# Altium project Robotic-Insect-Controller-Keypad-V1.PrjPcb
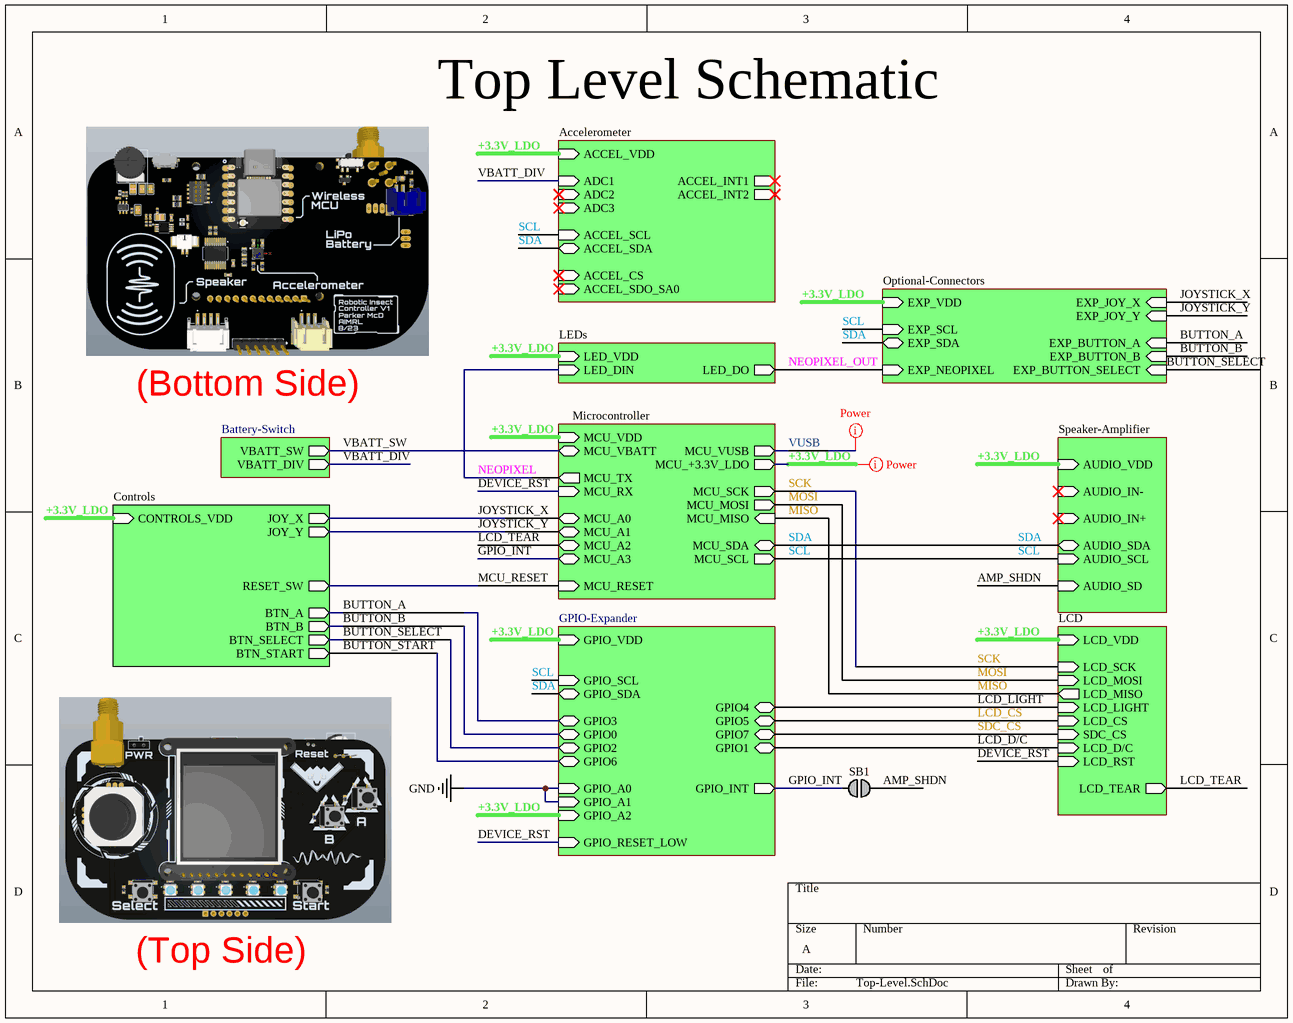
[diagram p0: Top-Level.SchDoc]
10 sheets, 73 parts. Net scope: hierarchical (ports join the sheet entries above them; power ports are global).
Board file: Robotic-Insect-Control-Keypad-V1.PcbDoc
Sheets:
  Top-Level.SchDoc
    Accelerometer = Accelerometer.SchDoc
    LCD = LCD.SchDoc
    Controls = Controls.SchDoc
    LEDs = LEDs.SchDoc
    Microcontroller = Microcontroller.SchDoc
    GPIO-Expander = GPIO-Expander.SchDoc
    Battery-Switch = Battery-Switch.SchDoc
    Speaker-Amplifier = Speaker-Amplifier.SchDoc
    Optional-Connectors = Optional-Connectors.SchDoc

## Sheet Top-Level.SchDoc
size A; SheetNumber: 1; SheetTotal: 10

### Parts
SB1  SB-OPEN-NO-PASTE  [PCB-SOLDERJUMPER-NOPASTE]  (value not drawn)  (no BOM)

### Sub-sheets
Accelerometer = Accelerometer.SchDoc: ACCEL_SDA (bidir), ACCEL_SCL (in), ACCEL_INT1 (out), ACCEL_INT2 (out), ADC1 (in), ADC2 (in), ADC3 (in), ACCEL_VDD (in), ACCEL_SDO_SA0 (in), ACCEL_CS (in)
Battery-Switch = Battery-Switch.SchDoc: VBATT_DIV (out), VBATT_SW (out)
Controls = Controls.SchDoc: BTN_A (out), BTN_B (out), BTN_SELECT (out), BTN_START (out), JOY_X (out), JOY_Y (out), CONTROLS_VDD (in), RESET_SW (out)
GPIO-Expander = GPIO-Expander.SchDoc: GPIO_SCL (in), GPIO_SDA (bidir), GPIO_RESET_LOW (in), GPIO_INT (out), GPIO_A0 (in), GPIO_A1 (in), GPIO_A2 (in), GPIO_VDD (in), GPIO0 (bidir), GPIO1 (bidir), GPIO2 (bidir), GPIO3 (bidir), GPIO4 (bidir), GPIO5 (bidir), GPIO6 (bidir), GPIO7 (bidir)
LCD = LCD.SchDoc: LCD_MOSI (in), LCD_MISO (out), LCD_SCK (in), LCD_CS (in), LCD_RST (in), LCD_D/C (in), SDC_CS (in), LCD_LIGHT (in), LCD_TEAR (out), LCD_VDD (in)
LEDs = LEDs.SchDoc: LED_DIN (in), LED_DO (out), LED_VDD (in)
Microcontroller = Microcontroller.SchDoc: MCU_RX (in), MCU_TX (out), MCU_SCL (out), MCU_SDA (bidir), MCU_MOSI (out), MCU_MISO (in), MCU_SCK (out), MCU_VUSB (out), MCU_A0 (bidir), MCU_A1 (bidir), MCU_A2 (bidir), MCU_A3 (bidir), MCU_RESET (in), MCU_+3.3V_LDO (out), MCU_VBATT (bidir), MCU_VDD (in)
Optional-Connectors = Optional-Connectors.SchDoc: EXP_SDA (bidir), EXP_SCL (in), EXP_VDD (in), EXP_NEOPIXEL (in), EXP_JOY_X (in), EXP_JOY_Y (in), EXP_BUTTON_A (in), EXP_BUTTON_B (in), EXP_BUTTON_SELECT (in)
Speaker-Amplifier = Speaker-Amplifier.SchDoc: AUDIO_SCL (in), AUDIO_SDA (bidir), AUDIO_VDD (in), AUDIO_SD (in), AUDIO_IN- (in), AUDIO_IN+ (in)

### Nets
GND: sheet GPIO-Expander/GPIO_A0, sheet GPIO-Expander/GPIO_A1
+3.3V_LDO: sheet Accelerometer/ACCEL_VDD, sheet LCD/LCD_VDD, sheet Controls/CONTROLS_VDD, sheet LEDs/LED_VDD, sheet Microcontroller/MCU_+3.3V_LDO, sheet Microcontroller/MCU_VDD, sheet GPIO-Expander/GPIO_A2, sheet GPIO-Expander/GPIO_VDD, sheet Speaker-Amplifier/AUDIO_VDD, sheet Optional-Connectors/EXP_VDD
AMP_SHDN: SB1.1 ; sheet Speaker-Amplifier/AUDIO_SD  [project net ~{SD}]
BUTTON_A: sheet Controls/BTN_A, sheet GPIO-Expander/GPIO3, sheet Optional-Connectors/EXP_BUTTON_A
BUTTON_B: sheet Controls/BTN_B, sheet GPIO-Expander/GPIO0, sheet Optional-Connectors/EXP_BUTTON_B
BUTTON_SELECT: sheet Controls/BTN_SELECT, sheet GPIO-Expander/GPIO2, sheet Optional-Connectors/EXP_BUTTON_SELECT
BUTTON_START: sheet Controls/BTN_START, sheet GPIO-Expander/GPIO6
DEVICE_RST: sheet LCD/LCD_RST, sheet Microcontroller/MCU_RX, sheet GPIO-Expander/GPIO_RESET_LOW
GPIO_INT: SB1.2 ; sheet Microcontroller/MCU_A3, sheet GPIO-Expander/GPIO_INT
JOYSTICK_X: sheet Controls/JOY_X, sheet Microcontroller/MCU_A0, sheet Optional-Connectors/EXP_JOY_X  [project net JOY_X]
JOYSTICK_Y: sheet Controls/JOY_Y, sheet Microcontroller/MCU_A1, sheet Optional-Connectors/EXP_JOY_Y  [project net JOY_Y]
LCD_CS: sheet LCD/LCD_CS, sheet GPIO-Expander/GPIO5
LCD_D/C: sheet LCD/LCD_D/C, sheet GPIO-Expander/GPIO1
LCD_LIGHT: sheet LCD/LCD_LIGHT, sheet GPIO-Expander/GPIO4
LCD_TEAR: sheet LCD/LCD_TEAR, sheet Microcontroller/MCU_A2
MCU_RESET: sheet Controls/RESET_SW, sheet Microcontroller/MCU_RESET
MISO: sheet LCD/LCD_MISO, sheet Microcontroller/MCU_MISO
MOSI: sheet LCD/LCD_MOSI, sheet Microcontroller/MCU_MOSI
NEOPIXEL: sheet LEDs/LED_DIN, sheet Microcontroller/MCU_TX  [project net MCU_TX]
NEOPIXEL_OUT: sheet LEDs/LED_DO, sheet Optional-Connectors/EXP_NEOPIXEL
SCK: sheet LCD/LCD_SCK, sheet Microcontroller/MCU_SCK
SCL: sheet Accelerometer/ACCEL_SCL, sheet Microcontroller/MCU_SCL, sheet GPIO-Expander/GPIO_SCL, sheet Speaker-Amplifier/AUDIO_SCL, sheet Optional-Connectors/EXP_SCL
SDA: sheet Accelerometer/ACCEL_SDA, sheet Microcontroller/MCU_SDA, sheet GPIO-Expander/GPIO_SDA, sheet Speaker-Amplifier/AUDIO_SDA, sheet Optional-Connectors/EXP_SDA
SDC_CS: sheet LCD/SDC_CS, sheet GPIO-Expander/GPIO7
VBATT_DIV: sheet Accelerometer/ADC1, sheet Battery-Switch/VBATT_DIV
VBATT_SW: sheet Microcontroller/MCU_VBATT, sheet Battery-Switch/VBATT_SW

### Layout directives
net class Power: +3.3V_LDO, VUSB

### Notes on the sheet
- Top Level Schematic
- (Bottom Side)
- (Top Side)

### Library data of the parts
SB1 = CMP-090-000003-4: Solder bridge, normally open, no solder paste.

## Sheet Accelerometer.SchDoc
size A; SheetNumber: 3; SheetTotal: 6
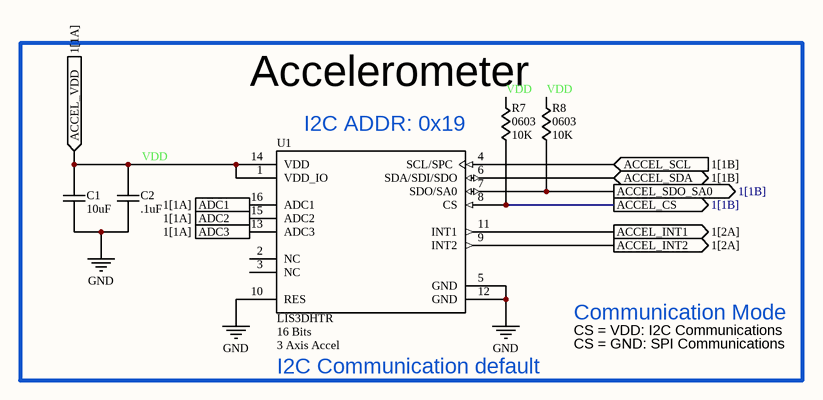
[diagram p1: Accelerometer.SchDoc]

### Parts
C1  value 10uF  [PCB-CAP-SMD-0603]  (hidden comment: CAP-SMD-0603)
C2  value .1uF  [PCB-CAP-SMD-0603]  (hidden comment: CAP-SMD-0603)
R7  value 10K  Footprint: 0603  [PCB-RES-SMD-0603]  (hidden comment: RES-SMD-0603)
R8  value 10K  Footprint: 0603  [PCB-RES-SMD-0603]  (hidden comment: RES-SMD-0603)
U1  Resolution: 16 Bits  Part Number: LIS3DHTR  Sensor Type: 3 Axis Accel  [PCB-LGA16_3X3MM]  (hidden comment: SEN-ACCEL-16BIT-LIS3DHTR)

### Ports
ACCEL_CS (out, see 1[1B]), ACCEL_INT1 (out, see 1[2A]), ACCEL_INT2 (out, see 1[2A]), ACCEL_SCL (in, see 1[1B]), ACCEL_SDA (bidir, see 1[1B]), ACCEL_SDO_SA0 (out, see 1[1B]), ACCEL_VDD (in, see 1[1A]), ADC1 (in, see 1[1A]), ADC2 (in, see 1[1A]), ADC3 (in, see 1[1A])

### Nets
GND: C1.2 C2.2 U1.5(GND) U1.10(RES) U1.12(GND)
SCL: U1.4(SCL/SPC) ; port ACCEL_SCL
SDA: U1.6(SDA/SDI/SDO) ; port ACCEL_SDA
VBATT_DIV: U1.16(ADC1) ; port ADC1
VDD: C1.1 C2.1 R7.2 R8.2 U1.1(VDD_IO) U1.14(VDD) ; port ACCEL_VDD  [project net +3.3V_LDO]
NetR7_1: R7.1 U1.8(CS) ; port ACCEL_CS
NetR8_1: R8.1 U1.7(SDO/SA0) ; port ACCEL_SDO_SA0
NetU1_9: U1.9(INT2) ; port ACCEL_INT2
NetU1_11: U1.11(INT1) ; port ACCEL_INT1
NetU1_13: U1.13(ADC3) ; port ADC3
NetU1_15: U1.15(ADC2) ; port ADC2

Not connected (* = marked no-connect by the designer): U1 2(NC) 3(NC)

### Notes on the sheet
- (near R7) Accelerometer
- (near U1) I2C ADDR: 0x19
- I2C Communication default
- Communication Mode
- CS = VDD: I2C Communications
- CS = GND: SPI Communications

### Library data of the parts
C1 C2 = CMP-00006-5: Generic (no part number) 0603 surface mount capacitor
R7 R8 = CMP-00002-4: Generic (no part number) 0603 surface mount resistor
U1 = CMP-062-000000-3: LIS3DHTR 3-Axis Accelerometer with I2C/SPI Interface    VDD: 1.71-3.6V  VDDIO: 1.71-VDD+0.1V  Scale: +/-2g, 4g, 8g, 16g with 16--bit data output  Temp:: -40Â°C - 85Â°C       Mouser: 511-LIS3DHTR Digikey: 497-10613-1-ND; Operating Supply Voltage: 2.5V; Axis: X, Y, Z; Operating Supply Current: 11uA; Interface: I2C,SPI; Max Supply Voltage (DC): 3.6V; Output Type: Digital; Bandwidth: 5kHz; Min Supply Voltage (DC): 1.71V; Max Operating Temperature: 85°C; Pins: 16; Height: 1mm; Depth: 3mm; Length: 3mm; Radiation Hardening: No; Lead Free: Lead Free; Min Operating Temperature: -40°C; RoHS Compliant: Yes; Packaging: Tape and Reel; Package Quantity: 4000; Series: -; Width: 3mm; Max Supply Voltage: 3.6V; Reach SVHC Compliant: No; Case/Package: LGA; Min Supply Voltage: 1.71V

## Sheet LCD.SchDoc
size A; SheetNumber: 4; SheetTotal: 6
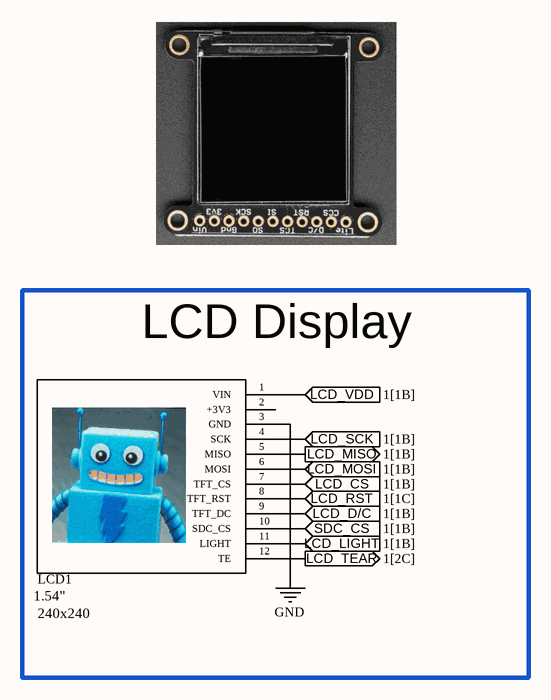
[diagram p2: LCD.SchDoc]

### Parts
LCD1  128x160: 240x240  1.8"TFT: 1.54"  [PCB-PCB-1.7X1.6-INCHES-DISP-LCD_QT154H2201]  (hidden comment: DISP-1.54-INCH-240x240-COLOR-LCD_QT154H2201)

### Blocks framed on the sheet
LCD Display: LCD1

### Ports
LCD_CS (in, see 1[1B]), LCD_D/C (in, see 1[1B]), LCD_LIGHT (in, see 1[1B]), LCD_MISO (out, see 1[1B]), LCD_MOSI (in, see 1[1B]), LCD_RST (in, see 1[1C]), LCD_SCK (in, see 1[1B]), LCD_TEAR (out, see 1[2C]), LCD_VDD (in, see 1[1B]), SDC_CS (in, see 1[1B])

### Nets
GND: LCD1.3(GND)
+3.3V_LDO: LCD1.1(VIN) ; port LCD_VDD
DEVICE_RST: LCD1.8(TFT_RST) ; port LCD_RST
LCD_CS: LCD1.7(TFT_CS) ; port LCD_CS
LCD_D/C: LCD1.9(TFT_DC) ; port LCD_D/C
LCD_LIGHT: LCD1.11(LIGHT) ; port LCD_LIGHT
LCD_TEAR: LCD1.12(TE) ; port LCD_TEAR
MISO: LCD1.5(MISO) ; port LCD_MISO
MOSI: LCD1.6(MOSI) ; port LCD_MOSI
SCK: LCD1.4(SCK) ; port LCD_SCK
SDC_CS: LCD1.10(SDC_CS) ; port SDC_CS

Not connected (* = marked no-connect by the designer): LCD1 2(+3V3)

### Library data of the parts
LCD1 = CMP-00049-4: Adafruit 1.54" 240x240 Wide Angle TFT LCD Display with MicroSD - ST7789 with EYESPI Connector; Part Number: 618

## Sheet Controls.SchDoc
size A; SheetNumber: 2; SheetTotal: 9
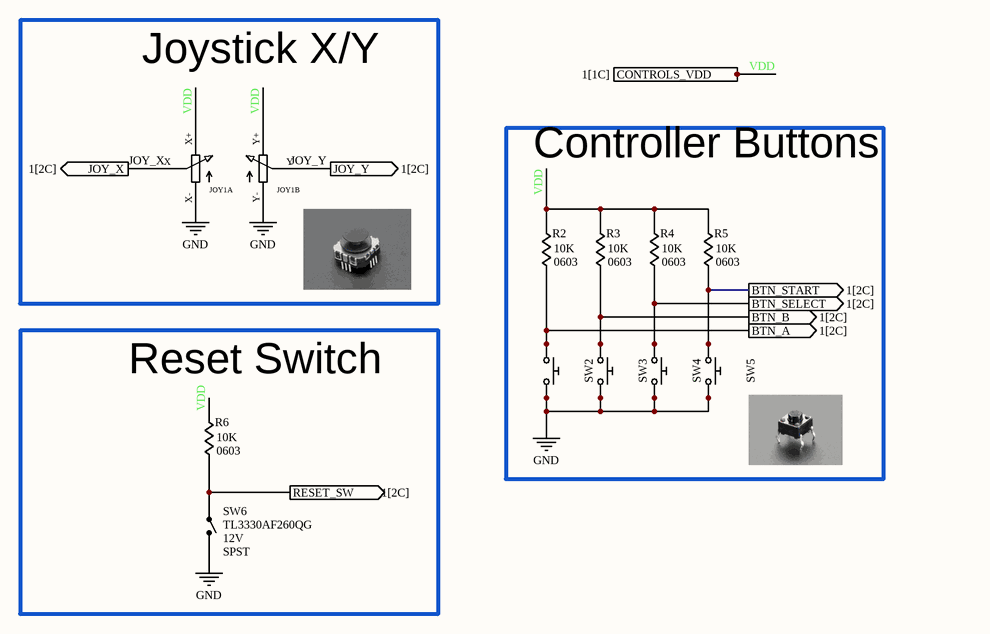
[diagram p3: Controls.SchDoc]

### Parts
JOY1  CTRL-JOYSTICK_ANALOG_XY  [PCB-JOYSTICK-ANALOG_MINITHM]  (value not drawn)  (parts A,B of 2)
R2  value 10K  Footprint: 0603  [PCB-RES-SMD-0603]  (hidden comment: RES-SMD-0603)
R3  value 10K  Footprint: 0603  [PCB-RES-SMD-0603]  (hidden comment: RES-SMD-0603)
R4  value 10K  Footprint: 0603  [PCB-RES-SMD-0603]  (hidden comment: RES-SMD-0603)
R5  value 10K  Footprint: 0603  [PCB-RES-SMD-0603]  (hidden comment: RES-SMD-0603)
R6  value 10K  Footprint: 0603  [PCB-RES-SMD-0603]  (hidden comment: RES-SMD-0603)
SW2  SWITCH-SMD-SMT-6MM  [PCB-SMD-SWITCH-6MM]  (value not drawn)
SW3  SWITCH-SMD-SMT-6MM  [PCB-SMD-SWITCH-6MM]  (value not drawn)
SW4  SWITCH-SMD-SMT-6MM  [PCB-SMD-SWITCH-6MM]  (value not drawn)
SW5  SWITCH-SMD-SMT-6MM  [PCB-SMD-SWITCH-6MM]  (value not drawn)
SW6  Voltage Rating (DC): 12V  Throw Configuration: SPST  Part Number: TL3330AF260QG  [PCB-SPST-TACTILE-RA]  (hidden comment: SWITCH-SPST-TACT-RA)

### Blocks framed on the sheet
Joystick X/Y: JOY1
Controller Buttons: R2-R5 SW2-SW5
Reset Switch: R6 SW6

### Ports
BTN_A (out, see 1[2C]), BTN_B (out, see 1[2C]), BTN_SELECT (out, see 1[2C]), BTN_START (out, see 1[2C]), CONTROLS_VDD (in, see 1[1C]), JOY_X (out, see 1[2C]), JOY_Y (out, see 1[2C]), RESET_SW (out, see 1[2C])

### Nets
GND: JOY1.X-(A) JOY1.Y-(A) SW2.B(S) SW2.B'(S1) SW3.B(S) SW3.B'(S1) SW4.B(S) SW4.B'(S1) SW5.B(S) SW5.B'(S1) SW6.2(S)
BUTTON_A: R2.1 SW2.A(P) SW2.A'(P1) ; port BTN_A
BUTTON_B: R3.1 SW3.A(P) SW3.A'(P1) ; port BTN_B
BUTTON_SELECT: R4.1 SW4.A(P) SW4.A'(P1) ; port BTN_SELECT
BUTTON_START: R5.1 SW5.A(P) SW5.A'(P1) ; port BTN_START
JOY_X: JOY1.X(S) ; port JOY_X
JOY_Y: JOY1.Y(S) ; port JOY_Y
MCU_RESET: R6.1 SW6.1(P) ; port RESET_SW
VDD: JOY1.X+(E) JOY1.Y+(E) R2.2 R3.2 R4.2 R5.2 R6.2 ; port CONTROLS_VDD  [project net +3.3V_LDO]
NetSW6_MT1: SW6.MT1(MT) SW6.MT2(MT)

### Library data of the parts
JOY1 = CMP-069-000000-7: 2-Axis analog joystick
R2-R6 = CMP-00002-4: as R7 on sheet Accelerometer
SW2-SW5 = CMP-067-000001-3: 6mm diameter tactile switch.; SymbolName_1: BUTTON_4PIN; GateName_1: G$1; DeviceSetName: SWITCH_TACT_SMT; DeviceName: _6MM8MMCAP; LibraryName: Adafruit PyGamer; Design Item ID: SWITCH_TACT_SMT_6MM8MMCAP; Source: Adafruit PyGamer.SCHLIB; Pin Count: 4; Component Type: Standard
SW6 = CMP-067-000003-2: Switch Tactile N.O. SPST Rectangular Button Gull Wing 0.05A 12VDC 2.55N SMD; Actuator Material: Nylon,Polyamide; Mechanical Life: 30000Cycles; Switch Travel: 0.25mm; Actuator Length: 1mm; Contact Resistance: 100mR; Operating Force: 260gf; Current Rating: 50mA; Switch Function: Off-Mom; Illumination Type: Non-Illuminated; Contact Material: Silver; Termination: Gull Wing; RoHS Compliant: Yes; Max Voltage Rating (DC): 12V; Mounting Technology: Surface Mount; Contact Plating: Silver; Series: TL3330; Electrical Life: 30000Cycles; Orientation: Right Angle; Min Operating Temperature: -20°C; Lead Free: Lead Free; Size: 3.4mm; Color: Black; Packaging: Tape and Reel; Case/Package: SMD/SMT; Package Quantity: 2300; Max Operating Temperature: 70°C

## Sheet LEDs.SchDoc
size A; SheetNumber: 5; SheetTotal: 9
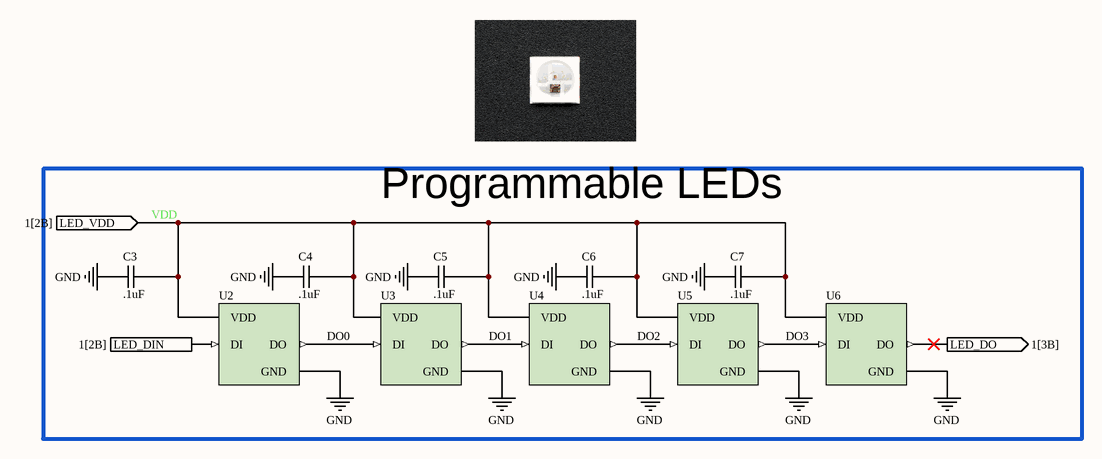
[diagram p4: LEDs.SchDoc]

### Parts
C3  value .1uF  [PCB-CAP-SMD-0603]  (hidden comment: CAP-SMD-0603)
C4  value .1uF  [PCB-CAP-SMD-0603]  (hidden comment: CAP-SMD-0603)
C5  value .1uF  [PCB-CAP-SMD-0603]  (hidden comment: CAP-SMD-0603)
C6  value .1uF  [PCB-CAP-SMD-0603]  (hidden comment: CAP-SMD-0603)
C7  value .1uF  [PCB-CAP-SMD-0603]  (hidden comment: CAP-SMD-0603)
U2  LED-RGB-SK6812B-3535  [PCB-SK6812B-3535-SMD-3.5X3.7MM]  (value not drawn)
U3  LED-RGB-SK6812B-3535  [PCB-SK6812B-3535-SMD-3.5X3.7MM]  (value not drawn)
U4  LED-RGB-SK6812B-3535  [PCB-SK6812B-3535-SMD-3.5X3.7MM]  (value not drawn)
U5  LED-RGB-SK6812B-3535  [PCB-SK6812B-3535-SMD-3.5X3.7MM]  (value not drawn)
U6  LED-RGB-SK6812B-3535  [PCB-SK6812B-3535-SMD-3.5X3.7MM]  (value not drawn)

### Blocks framed on the sheet
Programmable LEDs: C3-C7 U2-U6

### Ports
LED_DIN (in, see 1[2B]), LED_DO (out, see 1[3B]), LED_VDD (in, see 1[2B])

### Nets
GND: C3.1 C4.1 C5.1 C6.1 C7.1 U2.4(GND) U3.4(GND) U4.4(GND) U5.4(GND) U6.4(GND)
DO0: U2.3(DO) U3.1(DI)  [project net DO0_5]
DO1: U3.3(DO) U4.1(DI)  [project net DO1_5]
DO2: U4.3(DO) U5.1(DI)  [project net DO2_5]
DO3: U5.3(DO) U6.1(DI)  [project net DO3_5]
MCU_TX: U2.1(DI) ; port LED_DIN
NEOPIXEL_OUT: U6.3(DO) ; port LED_DO
VDD: C3.2 C4.2 C5.2 C6.2 C7.2 U2.2(VDD) U3.2(VDD) U4.2(VDD) U5.2(VDD) U6.2(VDD) ; port LED_VDD  [project net +3.3V_LDO]

### Library data of the parts
C3-C7 = CMP-00006-5: as C1 on sheet Accelerometer
U2-U6 = CMP-018-000000-9: 3.5x3.7x1.1 mm 0.2W Intelligent external control surface; SymbolName_1: WS2812BLED; DeviceSetName: WS2812B; DeviceName: 3535; GateName_1: G$1; LibraryName: adafruit; Package: LED3535; Source: adafruit.SCHLIB; Pin Count: 4; Design Item ID: WS2812B3535; Component Type: Standard

## Sheet Microcontroller.SchDoc
size A; SheetNumber: 6; SheetTotal: 9
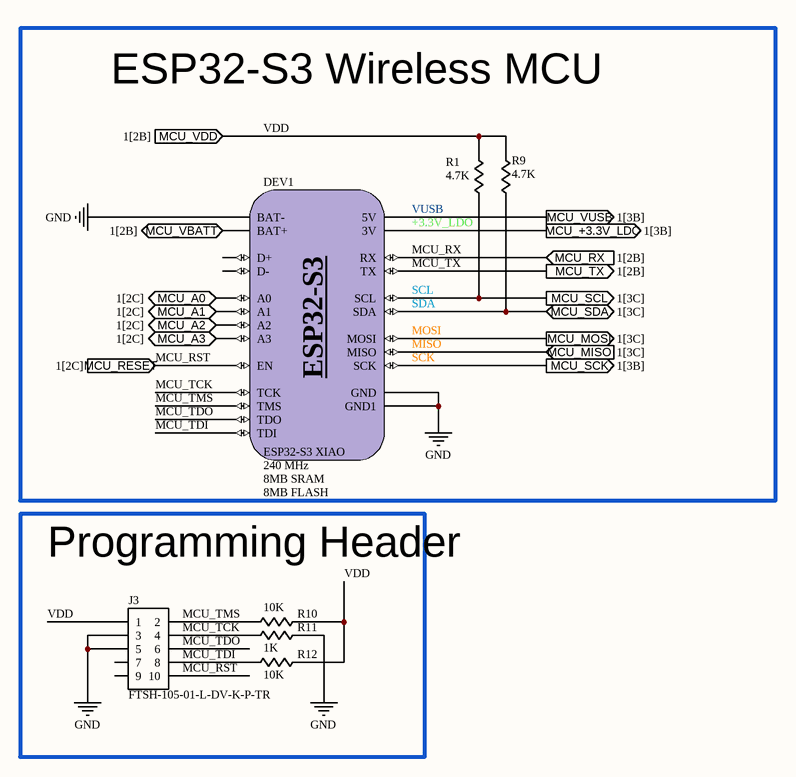
[diagram p5: Microcontroller.SchDoc]

### Parts
DEV1  RAM: 8MB SRAM  Flash: 8MB FLASH  Speed: 240 MHz  Part Number: ESP32-S3 XIAO  [PCB-ESP32-S3-XIAO-SMD]  (hidden comment: MCU-DEV-ESP32-S3-XIAO)
J3  Part Number: FTSH-105-01-L-DV-K-P-TR  [PCB-BOX-HEADER-10PIN-FP-FTSH-105-01-L-DV-K-P-T-MFG]  (hidden comment: CONN-BOX-HDR-10PIN-FTSH-105-01-L-DV-K-P-TR)
R1  value 4.7K  [PCB-RES-SMD-0805]  (hidden comment: RES-SMD-0805)
R9  value 4.7K  [PCB-RES-SMD-0805]  (hidden comment: RES-SMD-0805)
R10  value 10K  [PCB-RES-SMD-0805]  (hidden comment: RES-SMD-0805)
R11  value 1K  [PCB-RES-SMD-0805]  (hidden comment: RES-SMD-0805)
R12  value 10K  [PCB-RES-SMD-0805]  (hidden comment: RES-SMD-0805)

### Blocks framed on the sheet
ESP32-S3 Wireless MCU: DEV1 R1 R9
Programming Header: J3 R10-R12

### Ports
MCU_+3.3V_LDO (out, see 1[3B]), MCU_A0 (bidir, see 1[2C]), MCU_A1 (bidir, see 1[2C]), MCU_A2 (bidir, see 1[2C]), MCU_A3 (bidir, see 1[2C]), MCU_MISO (in, see 1[3C]), MCU_MOSI (out, see 1[3C]), MCU_RESET (in, see 1[2C]), MCU_RX (in, see 1[2B]), MCU_SCK (out, see 1[3B]), MCU_SCL (out, see 1[3C]), MCU_SDA (bidir, see 1[3C]), MCU_TX (out, see 1[2B]), MCU_VBATT (bidir, see 1[2B]), MCU_VDD (in, see 1[2B]), MCU_VUSB (out, see 1[3B])

### Nets
GND: DEV1.BAT- DEV1.GND DEV1.GND1 J3.3 J3.5 R11.2
+3.3V_LDO: DEV1.3V J3.1 R1.2 R9.2 R10.2 R12.2 ; port MCU_+3.3V_LDO, port MCU_VDD  [also labelled VDD]
GPIO_INT: DEV1.A3 ; port MCU_A3
JOY_X: DEV1.A0 ; port MCU_A0
JOY_Y: DEV1.A1 ; port MCU_A1
LCD_TEAR: DEV1.A2 ; port MCU_A2
MCU_RST: DEV1.EN J3.10 ; port MCU_RESET  [project net MCU_RESET]
MCU_RX: DEV1.RX ; port MCU_RX  [project net DEVICE_RST]
MCU_TCK: DEV1.TCK J3.4 R11.1  [project net MCU_TCK_6]
MCU_TDI: DEV1.TDI J3.8 R12.1  [project net MCU_TDI_6]
MCU_TDO: DEV1.TDO J3.6  [project net MCU_TDO_6]
MCU_TMS: DEV1.TMS J3.2 R10.1  [project net MCU_TMS_6]
MCU_TX: DEV1.TX ; port MCU_TX
MISO: DEV1.MISO ; port MCU_MISO
MOSI: DEV1.MOSI ; port MCU_MOSI
SCK: DEV1.SCK ; port MCU_SCK
SCL: DEV1.SCL R1.1 ; port MCU_SCL
SDA: DEV1.SDA R9.1 ; port MCU_SDA
VBATT_SW: DEV1.BAT+ ; port MCU_VBATT
VUSB: DEV1.5V ; port MCU_VUSB

Not connected (* = marked no-connect by the designer): DEV1 D+ D-; J3 7 9

### Notes on the sheet
- (in symbol CMP-00021-5) ESP32-S3

### Library data of the parts
DEV1 = CMP-00021-5: SMD IC ESP32-S3, Dual-core MCU with WiFi and BLE support.
J3 = CMP-00034-4: Conn Unshrouded Header HDR 10 POS 1.27mm Solder ST Top Entry SMD T/R; Max Current Rating: 1.75A; Number of Positions: 10; Gender: Male; Contact Shape: Square; Flammability Rating: UL94 V-0; Fastening Type: Pull; Length: 6.35mm; RoHS Compliant: Yes; Housing Color: Black; Contact Material: Bronze; Packaging: Tape and Reel; Contact Type: Male Pin; Number of Rows: 2; Contact Plating: Gold; Orientation: Straight; Series: FTSH; Lead Free: Lead Free; Termination: Solder; Number of Contacts: 10; Insulation Color: Black; Pitch: 1.27mm; Housing Material: Polymer; Insulation Material: Polymer; Min Operating Temperature: -55°C; Radiation Hardening: No; Depth: 5.84mm; Max Operating Temperature: 125°C
R1 R9-R12 = CMP-00003-4: Generic (no part number) 0805 surface mount resistor

## Sheet GPIO-Expander.SchDoc
size A; SheetNumber: 8; SheetTotal: 9
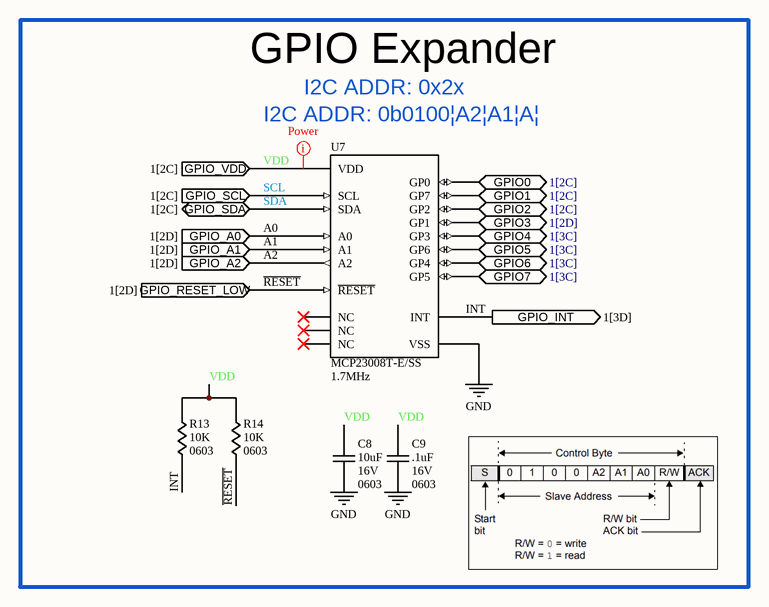
[diagram p6: GPIO-Expander.SchDoc]

### Parts
C8  value 10uF  Voltage: 16V  Footprint: 0603  [PCB-CAP-SMD-0603]  (hidden comment: CAP-SMD-0603)
C9  value .1uF  Voltage: 16V  Footprint: 0603  [PCB-CAP-SMD-0603]  (hidden comment: CAP-SMD-0603)
R13  value 10K  Footprint: 0603  [PCB-RES-SMD-0603]  (hidden comment: RES-SMD-0603)
R14  value 10K  Footprint: 0603  [PCB-RES-SMD-0603]  (hidden comment: RES-SMD-0603)
U7  Frequency: 1.7MHz  Part Number: MCP23008T-E/SS  [PCB-TSSOP-20-.65MM-7.2x5.2MM]  (hidden comment: IC-GPIO-EXPANDER-I2C-8CH-MCP23008T-E/SS)

### Ports
GPIO0 (bidir, see 1[2C]), GPIO1 (bidir, see 1[2C]), GPIO2 (bidir, see 1[2C]), GPIO3 (bidir, see 1[2D]), GPIO4 (bidir, see 1[3C]), GPIO5 (bidir, see 1[3C]), GPIO6 (bidir, see 1[3C]), GPIO7 (bidir, see 1[3C]), GPIO_A0 (in, see 1[2D]), GPIO_A1 (in, see 1[2D]), GPIO_A2 (in, see 1[2D]), GPIO_INT (out, see 1[3D]), GPIO_RESET_LOW (in, see 1[2D]), GPIO_SCL (in, see 1[2C]), GPIO_SDA (bidir, see 1[2C]), GPIO_VDD (in, see 1[2C])

### Nets
GND: C8.1 C9.1 U7.4(A1) U7.5(A0) U7.9(VSS) ; port GPIO_A0, port GPIO_A1  [also labelled A0, A1]
A2: C8.2 C9.2 R13.2 R14.2 U7.3(A2) U7.20(VDD) ; port GPIO_A2, port GPIO_VDD  [also labelled VDD]  [project net +3.3V_LDO]
BUTTON_A: U7.13(GP1) ; port GPIO3
BUTTON_B: U7.12(GP0) ; port GPIO0
BUTTON_SELECT: U7.14(GP2) ; port GPIO2
BUTTON_START: U7.16(GP4) ; port GPIO6
INT: R13.1 U7.8(INT) ; port GPIO_INT  [project net GPIO_INT]
LCD_CS: U7.18(GP6) ; port GPIO5
LCD_D/C: U7.19(GP7) ; port GPIO1
LCD_LIGHT: U7.15(GP3) ; port GPIO4
~{RESET}: R14.1 U7.6(~{RESET}) ; port GPIO_RESET_LOW  [project net DEVICE_RST]
SCL: U7.1(SCL) ; port GPIO_SCL
SDA: U7.2(SDA) ; port GPIO_SDA
SDC_CS: U7.17(GP5) ; port GPIO7

Not connected (* = marked no-connect by the designer): U7 7(NC)* 10(NC)* 11(NC)*

### Layout directives
net class Power: +3.3V_LDO

### Notes on the sheet
- GPIO Expander
- I2C ADDR: 0x2x
- (near U7) I2C ADDR: 0b0100|A2|A1|A|

### Library data of the parts
C8 C9 = CMP-00006-5: as C1 on sheet Accelerometer
R13 R14 = CMP-00002-4: as R7 on sheet Accelerometer
U7 = CMP-00069-3: MCP23008 Series 5.5 V 1.7 MHz 8-Bit I/O Expander with Serial Interface - SSOP-20; Interface: I2C,Serial; Operating Supply Voltage: 5.5V; Power Dissipation: 700mW; Supply Current: 1mA; Output Type: PUSH-PULL; Number of I/Os: 8; Number of Channels: 1; Lead Free: Lead Free; Package Quantity: 1600; Series: -; Case/Package: SSOP; Pins: 20; Min Operating Temperature: -40°C; RoHS Compliant: Yes; Nominal Supply Voltage: 5.5V; Packaging: Tape and Reel; Max Operating Temperature: 125°C; Clock Frequency: 1.7MHz

## Sheet Battery-Switch.SchDoc
size A; SheetNumber: 8; SheetTotal: 10
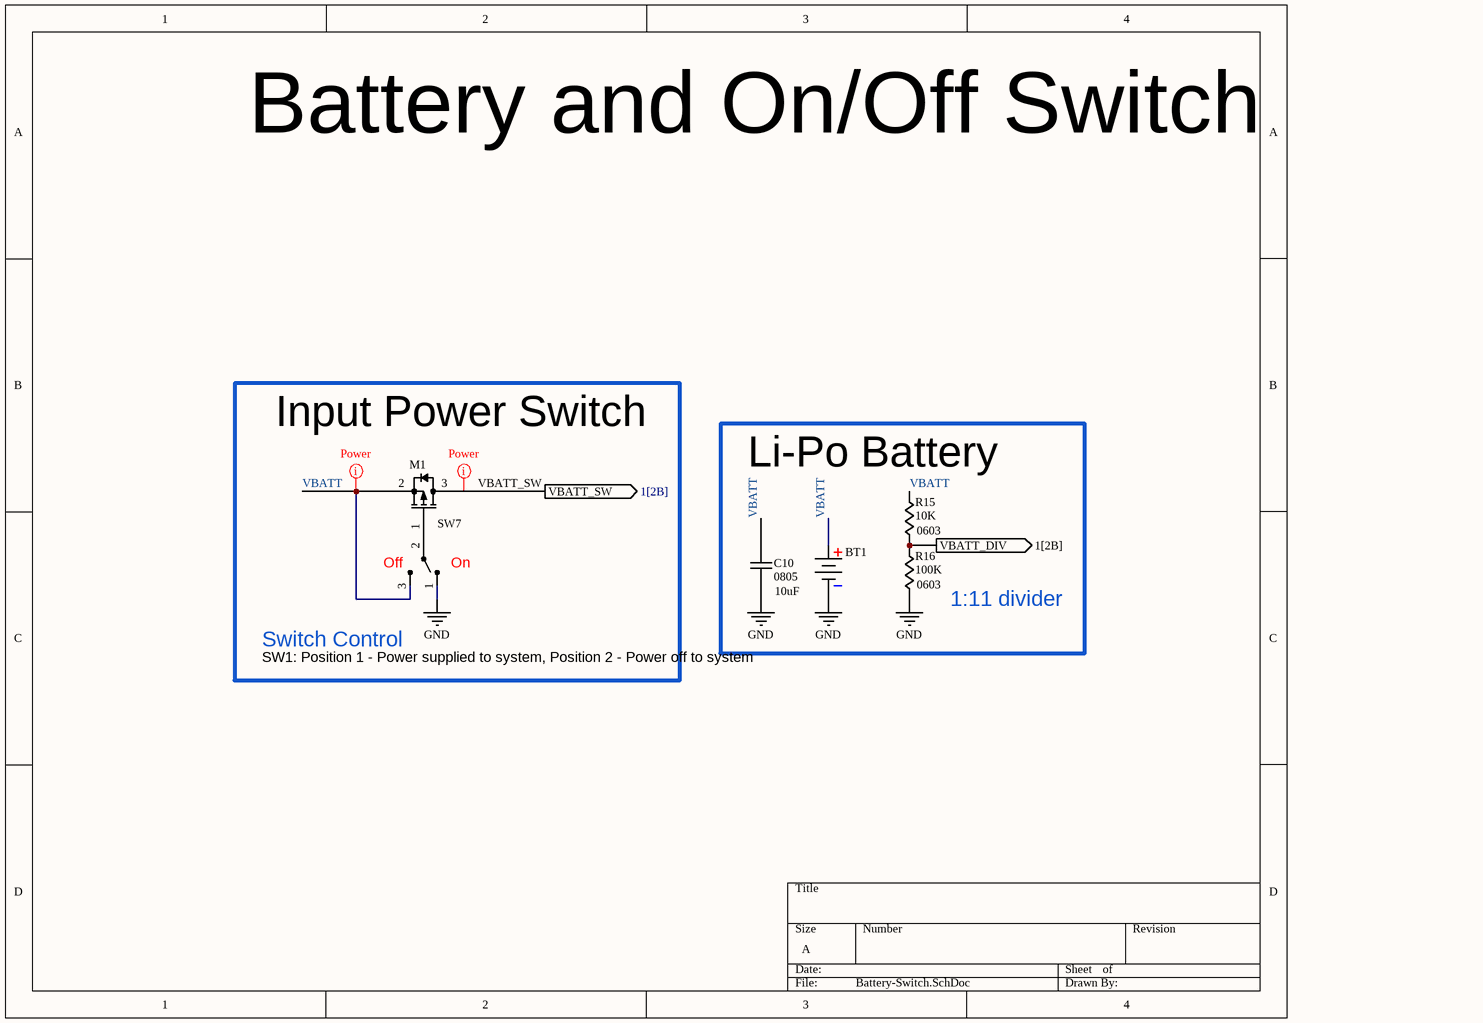
[diagram p7: Battery-Switch.SchDoc]

### Parts
BT1  BATT-JST-S2BPHSM4TBLFSN  [PCB-CONN-JST- S2B-PH-SM4-TB(LF)(SN)-2_V]  (value not drawn)
C10  value 10uF  Footprint: 0805  [PCB-CAP-SMA-0805]  (hidden comment: CAP-SMD-0805)
M1  TR-MOSFET-P-CH-SOT-23-GENERIC  [PCB-SOT-23]  (value not drawn)
R15  value 10K  Footprint: 0603  [PCB-RES-SMD-0603]  (hidden comment: RES-SMD-0603)
R16  value 100K  Footprint: 0603  [PCB-RES-SMD-0603]  (hidden comment: RES-SMD-0603)
SW7  SWITCH-SPDT-SMD-SSSS811101  [PCB-SPDT_SMT_SSSS811101]  (value not drawn)

### Blocks framed on the sheet
Input Power Switch: M1 SW7
Li-Po Battery: BT1 C10 R15 R16

### Ports
VBATT_DIV (out, see 1[2B]), VBATT_SW (out, see 1[2B])

### Nets
GND: BT1.2 C10.1 R16.2 SW7.1
VBATT: BT1.1 C10.2 M1.2(S) R15.1 SW7.3  [project net VBATT_8]
VBATT_DIV: R15.2 R16.1 ; port VBATT_DIV
VBATT_SW: M1.3(D) ; port VBATT_SW
NetM1_1: M1.1(G) SW7.2

Not connected (* = marked no-connect by the designer): BT1 MP1 MP2

### Layout directives
net class Power: VBATT_8, VBATT_SW

### Notes on the sheet
- Battery and On/Off Switch
- (near SW7) Off
- (near SW7) On
- 1:11 divider
- SW1: Position 1 - Power supplied to system, Position 2 - Power off to system
- Switch Control

### Library data of the parts
BT1 = CMP-002-00007-1: Connector Header, PH Series, 2 Position, Side Entry, 2.00mm, Solder, Surface Mount, Natural for connecting to a battery.; Insulation Resistance: 1GR; Contact Resistance: 20mR; Current Rating: 2A; Working Voltage: 100V; Gender: Male; Pitch: 2mm; Number of Contacts: 2; Depth: 8.6mm; Lead Free: Lead Free; Series: PH; Length: 7.9mm; Flammability Rating: UL94 V-0; Max Operating Temperature: 85°C; Contact Material: Tin,Copper Alloy,Bronze,Brass; Reach SVHC Compliant: No; Min Operating Temperature: -25°C; Width: 5mm; Packaging: Tape and Reel; Color: White; Voltage Rating (AC): 100V; Contact Plating: Tin,Copper; Housing Material: Polyamide; Number of Rows: 1; Max Voltage Rating (AC): 100V; Orientation: Right Angle; Voltage Rating: 100V; Max Current Rating: 2A; Housing Color: Beige; Termination: Solder; Height: 9.4mm
C10 = CMP-00007-4: Generic (no part number) 0805 surface mount resistor
M1 = CMP-00035-6: MOSFET P-CH 20V 1.3A SOT-23
R15 R16 = CMP-00002-4: as R7 on sheet Accelerometer
SW7 = CMP-067-000002-3: Toggle switch; GateName_1: G$1; DeviceSetName: SWITCH_SPDT; Component Type: Standard; SymbolName_1: SWITCH_SPDT; LibraryName: Adafruit PyGamer; Design Item ID: SWITCH_SPDT; Package: SPDT_SMT_SSSS811101; Pin Count: 3; Source: Adafruit PyGamer.SCHLIB

## Sheet Speaker-Amplifier.SchDoc
size A; SheetNumber: 9; SheetTotal: 9
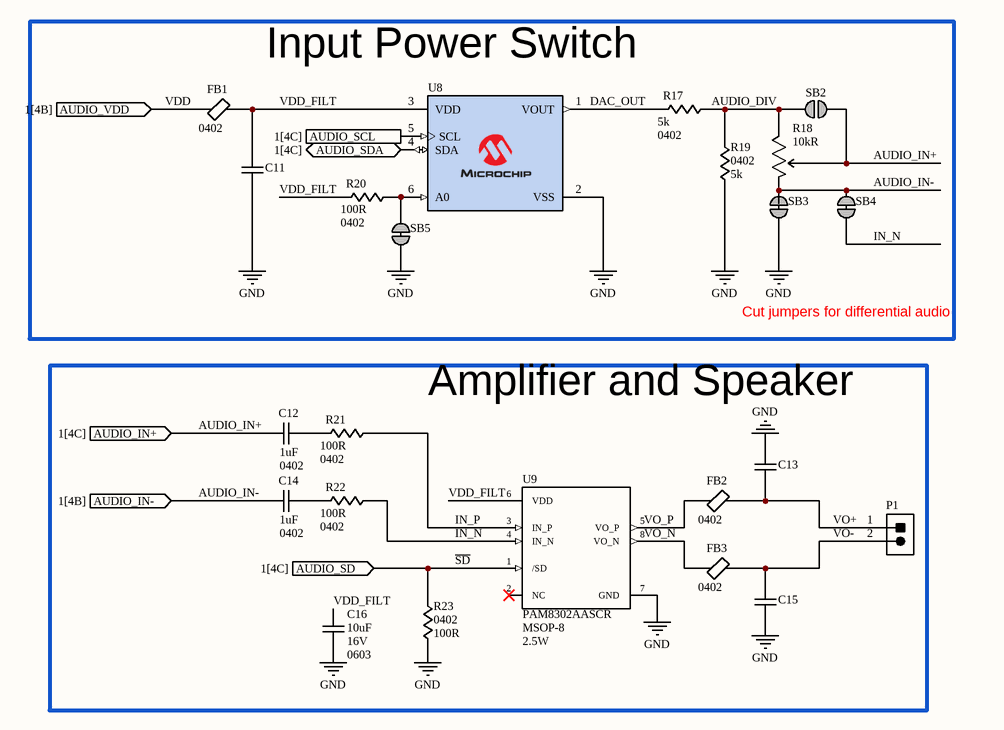
[diagram p8: Speaker-Amplifier.SchDoc]

### Parts
C11  CAP-SMD-0402  [PCB-CAP-SMD-0402]  (value not drawn)
C12  value 1uF  Voltage: 0402  [PCB-CAP-SMD-0402]  (hidden comment: CAP-SMD-0402)
C13  CAP-SMD-0402  [PCB-CAP-SMD-0402]  (value not drawn)
C14  value 1uF  Voltage: 0402  [PCB-CAP-SMD-0402]  (hidden comment: CAP-SMD-0402)
C15  CAP-SMD-0402  [PCB-CAP-SMD-0402]  (value not drawn)
C16  value 10uF  Voltage: 16V  Footprint: 0603  [PCB-CAP-SMD-0603]  (hidden comment: CAP-SMD-0603)
FB1  Footprint: 0402  [PCB-SMD-FERRITE-0402]  (hidden comment: FERRITE-SMD-GENERIC-0402)
FB2  Footprint: 0402  [PCB-SMD-FERRITE-0402]  (hidden comment: FERRITE-SMD-GENERIC-0402)
FB3  Footprint: 0402  [PCB-SMD-FERRITE-0402]  (hidden comment: FERRITE-SMD-GENERIC-0402)
P1  CONN-PICOBLADE-SMD-1.25MM-2PIN-53261-0271  [PCB-PICOBLADE-2PIN-1.25MM]  (value not drawn)
R17  value 5k  Footprint: 0402  [PCB-RES-SMA-0402]  (hidden comment: RES-SMD-0402)
R18  value 10kR  [PCB-FP-3352T-MFG]  (hidden comment: POT-THUMB-9MM-3352T-1-103LF)
R19  value 5k  Footprint: 0402  [PCB-RES-SMA-0402]  (hidden comment: RES-SMD-0402)
R20  value 100R  Footprint: 0402  [PCB-RES-SMA-0402]  (hidden comment: RES-SMD-0402)
R21  value 100R  Footprint: 0402  [PCB-RES-SMA-0402]  (hidden comment: RES-SMD-0402)
R22  value 100R  Footprint: 0402  [PCB-RES-SMA-0402]  (hidden comment: RES-SMD-0402)
R23  value 100R  Footprint: 0402  [PCB-RES-SMA-0402]  (hidden comment: RES-SMD-0402)
SB2  SB-OPEN-NO-PASTE  [PCB-SOLDERJUMPER-NOPASTE]  (value not drawn)  (no BOM)
SB3  SB-CLOSED-NO-PASTE  [-SOLDERJUMPER-CLOSEDWIRE]  (value not drawn)  (net tie, no BOM)
SB4  SB-CLOSED-NO-PASTE  [-SOLDERJUMPER-CLOSEDWIRE]  (value not drawn)  (net tie, no BOM)
SB5  SB-CLOSED-NO-PASTE  [-SOLDERJUMPER-CLOSEDWIRE]  (value not drawn)  (net tie, no BOM)
U8  IC-DAC-12BIT-1CH-I2C-MCP4725A0T-E/CH  [PCB-MCP4725-MSOP-10-3X3MM]  (value not drawn)
U9  Case/Package: MSOP-8  Output Power: 2.5W  Part Number: PAM8302AASCR  [PCB-MSOP-8-.65MM]  (hidden comment: IC-AUDIO-AMP-2.5W-PAM8302AASCR)

### Blocks framed on the sheet
Input Power Switch: C11 FB1 R17-R20 SB2-SB5 U8
Amplifier and Speaker: C12-C16 FB2 FB3 P1 R21-R23 U9

### Ports
AUDIO_IN+ (in, see 1[4C]), AUDIO_IN- (in, see 1[4B]), AUDIO_SCL (in, see 1[4C]), AUDIO_SD (in, see 1[4C]), AUDIO_SDA (bidir, see 1[4C]), AUDIO_VDD (in, see 1[4B])

### Nets
GND: C11.1 C13.2 C15.1 C16.1 R19.2 R23.1 SB3.2 SB5.2 U8.2(VSS) U9.7(GND)
~{SD}: R23.2 U9.1(/SD) ; port AUDIO_SD
AUDIO_DIV: R17.2 R18.1(CCW) R19.1 SB2.2  [project net AUDIO_DIV_9]
AUDIO_IN+: C12.1 R18.2(WIPER) SB2.1 ; port AUDIO_IN+
AUDIO_IN-: C14.1 R18.3(CW) SB3.1 SB4.1 ; port AUDIO_IN-
DAC_OUT: R17.1 U8.1(VOUT)  [project net DAC_OUT_9]
IN_N: R22.2 SB4.2 U9.4(IN_N)  [project net IN_N_9]
IN_P: R21.2 U9.3(IN_P)  [project net IN_P_9]
SCL: U8.5(SCL) ; port AUDIO_SCL
SDA: U8.4(SDA) ; port AUDIO_SDA
VDD: FB1.1 ; port AUDIO_VDD  [project net +3.3V_LDO]
VDD_FILT: C11.2 C16.2 FB1.2 R20.1 U8.3(VDD) U9.6(VDD)  [project net VDD_FILT_9]
VO+: C13.1 FB2.2 P1.1  [project net VO+_9]
VO-: C15.2 FB3.2 P1.2  [project net VO-_9]
VO_N: FB3.1 U9.8(VO_N)  [project net VO_N_9]
VO_P: FB2.1 U9.5(VO_P)  [project net VO_P_9]
NetC12_2: C12.2 R21.1
NetC14_2: C14.2 R22.1
NetP1_MP1: P1.MP1 P1.MP2
NetR20_2: R20.2 SB5.1 U8.6(A0)

Not connected (* = marked no-connect by the designer): U9 2(NC)*

### Notes on the sheet
- Cut jumpers for differential audio

### Library data of the parts
C11-C15 = CMP-00005-8: Generic (no part number) 0402 surface mount capacitor
C16 = CMP-00006-5: as C1 on sheet Accelerometer
FB1-FB3 = CMP-00058-1: Generic (no part number) 0402 ferrite bead
P1 = CMP-00092-1: 1.25mm Pitch PicoBlade™ Header, Surface Mount, Right Angle, Lead-Free, 2 Circuits; Current Rating: 1A; Voltage Rating (DC): 125V; Glow Wire Compliant: Non-compliant; Number of Contacts: 2; Insulation Resistance: 100MR; Gender: Male; Contact Resistance: 20mR; Orientation: Right Angle; Color: Natural; Min Operating Temperature: -40°C; Housing Color: Natural; Max Operating Temperature: 85°C; Fastening Type: Detent; Packaging: Tape and Reel; Series: PicoBlade; Contact Material: Bronze,Tin; Number of Rows: 1; Radiation Hardening: No; Flammability Rating: UL94 V-0; Voltage Rating (AC): 125V; Contact Shape: Rectangular; Insulation Material: Nylon; Lead Pitch: 1.25mm; Housing Material: Nylon; Depth: 5.2mm; Working Voltage: 125V; Connector Type: Header; Contact Plating: Tin; Insulation Color: Natural; Number of Circuits: 2; Contact Finish - Mating: TIN; Termination: Solder; Reach SVHC Compliant: Unknown; Contact Type: Blade Pin; RoHS Compliant: Yes; Mounting Technology: Surface Mount; Package Quantity: 1000; Lead Free: Lead Free; Voltage Rating: 125V; Number of Positions: 2; Pitch: 1.25mm
R17 R19-R23 = CMP-00001-3: Generic (no part number) 0402 surface mount resistor
R18 = CMP-00093-1: Trimmer Potentiometer 10k Ohm 20% 1/2 Watt 1 Turn Pin Through Hole; Max Power Dissipation: 500mW; Number of Turns: 1; Temperature Coefficient: 100ppm/°C; Voltage Rating: 250V; Diameter: 8.89mm; Power Rating: 500mW; Min Operating Temperature: -55°C; Resistance Tolerance: 20%; Mounting Technology: Through Hole,PCB; Color: Black; Technology: CERMET; Termination: Pin; Lead Free: Lead Free; Series: Trimpot® 3352 - Open Frame; Max Operating Temperature: 125°C; Resistor Type: Cermet; Length: 8.89mm; Width: 8.89mm; Packaging: Bag; Military Standard: Not; Reach SVHC Compliant: No; Radiation Hardening: No; Tolerance: 20%; Weight: 0.01oz; Height: 3.81mm; Taper: Linear; RoHS Compliant: Yes; Depth: 9.53mm
SB2 = CMP-090-000003-4: as SB1 on sheet Top-Level
SB3-SB5 = CMP-090-000001-3: Solder bridge, normally closed
U8 = CMP-00009-5: IC DAC 12BIT W/I2C SOT23A-6; Number of Bits: 12; Differential Output: No; Number of D/A Converters: 1; Resolution: 12b; Input Offset Voltage (Vos): 1.1mV; Settling Time: 6us; Input Type: SERIAL; Integral Nonlinearity (INL): 14.5LSB; Supply Current: 210uA; Output Polarity: Unipolar; Min Supply Voltage: 2.7V; Max Supply Voltage: 5.5V; Interface: I2C,Serial,2-Wire; Output Type: Voltage; RoHS Compliant: Yes; Mounting Technology: Surface Mount; Min Operating Temperature: -40°C; Height: 1.3mm; Max Operating Temperature: 125°C; Package Quantity: 3000; Termination: SMD/SMT; Number of Channels: 1; Series: -; Radiation Hardening: No; Number of Outputs: 1; Lead Free: Lead Free; Width: 1.8mm; Pins: 6; Number of Converters: 1; Packaging: Tape and Reel; Reach SVHC Compliant: No; Number of DAC Channels: 1; Case/Package: SOT-23-6; Length: 3.1mm
U9 = CMP-00047-2: IC AMP AUDIO 2.5W CLASS D 8MSOP; Supply Current: 8mA; Operating Supply Current: 4mA; Number of Channels: 1; Min Supply Voltage: 2V; Supply Type: Single; Max Supply Voltage: 5.5V; Power Supply Rejection Ratio (PSRR): 50dB; Voltage Gain: 24dB; Mounting Technology: Surface Mount; Package Quantity: 2500; Series: -; Weight: 0.004938oz; Pins: 8; Max Output Power: 2.5W; RoHS Compliant: Yes; Packaging: Tape and Reel; Radiation Hardening: No; Lead Free: Lead Free; Max Operating Temperature: 85°C; Min Operating Temperature: -40°C

## Sheet Optional-Connectors.SchDoc
size A; SheetNumber: 10; SheetTotal: 10
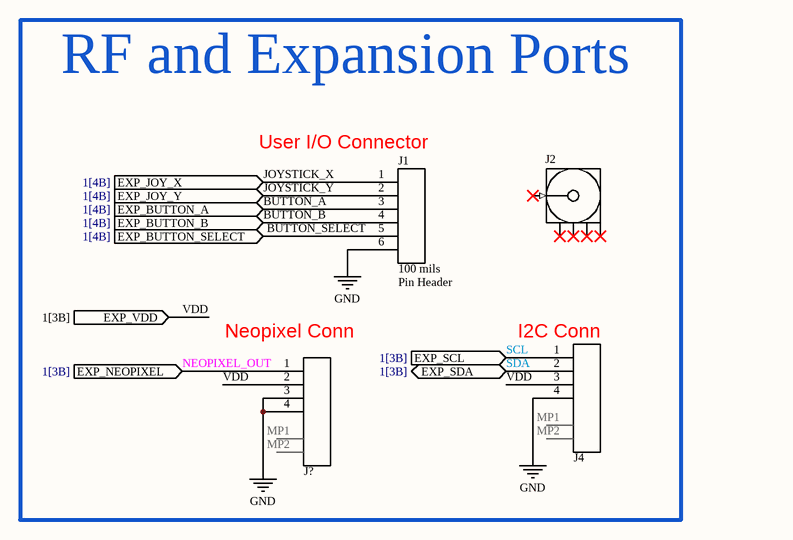
[diagram p9: Optional-Connectors.SchDoc]

### Parts
J1  Pitch: 100 mils  Part Number: Pin Header  [PCB-CONN-PIN-HEADER-6-PIN-100-MIL]  (hidden comment: CONN-PIN-HEADER-6-PINS-100-MIL)
J2  CONN-RF-SMA-THRU-RA  [PCB-CON-SMA-RA-NO-FEED]  (value not drawn)
J4  CONN-JST-4PIN-2MM-S4B-PH-SM4-TB(LF)(SN)  [PCB-CONN-JST- S4B-PH-SM4-TB(LF)(SN)3]  (value not drawn)
J?  CONN-JST-4PIN-2MM-S4B-PH-SM4-TB(LF)(SN)  [PCB-CONN-JST- S4B-PH-SM4-TB(LF)(SN)3]  (value not drawn)

### Ports
EXP_BUTTON_A (in, see 1[4B]), EXP_BUTTON_B (in, see 1[4B]), EXP_BUTTON_SELECT (in, see 1[4B]), EXP_JOY_X (in, see 1[4B]), EXP_JOY_Y (in, see 1[4B]), EXP_NEOPIXEL (in, see 1[3B]), EXP_SCL (in, see 1[3B]), EXP_SDA (bidir, see 1[3B]), EXP_VDD (in, see 1[3B])

### Nets
GND: J1.6 J4.4 J?.3 J?.4
BUTTON_A: J1.3 ; port EXP_BUTTON_A
BUTTON_B: J1.4 ; port EXP_BUTTON_B
BUTTON_SELECT: J1.5 ; port EXP_BUTTON_SELECT
JOYSTICK_X: J1.1 ; port EXP_JOY_X  [project net JOY_X]
JOYSTICK_Y: J1.2 ; port EXP_JOY_Y  [project net JOY_Y]
NEOPIXEL_OUT: J?.1 ; port EXP_NEOPIXEL
SCL: J4.1 ; port EXP_SCL
SDA: J4.2 ; port EXP_SDA
VDD: J4.3 J?.2 ; port EXP_VDD  [project net +3.3V_LDO]

Not connected (* = marked no-connect by the designer): J2 1(Signal)* 2(GND)* 3(GND)* 4(GND)* 5(GND)*; J4 MP1 MP2; J? MP1 MP2

### Notes on the sheet
- RF and Expansion Ports
- (near J1) User I/O Connector
- (near J?) Neopixel Conn
- (near J4) I2C Conn

### Library data of the parts
J1 = CMP-00051-2: PinHeader 1x6 TH Pitch 2.54mm
J2 = CMP-00094-2: RP-SMA Connector Right Angle Jack (Female), PCB Through-Hole Mount, Nickel; Polarity: Reverse; Center Contact Plating: Gold; Impedance: 50R; Clock Frequency: 12.4GHz; Dielectric Material: PTFE; Body Material: Brass; Number of Ports: 1; Mating Cycles: 500; Connector Type: SMA,Receptacle,Male Pin; Lead Free: Lead Free; Package Quantity: 100; Contact Plating: Gold; Termination: Solder; Mounting Technology: Through Hole; Length: 15.1mm; Plating: Nickel; Case/Package: SMA; Min Operating Temperature: -65°C; Body Plating: Nickel; RoHS Compliant: Yes; Housing Color: Silver; Orientation: Right Angle; Packaging: Tray; Max Operating Temperature: 165°C; Series: -; Fastening Type: Threaded; Contact Material: Copper
J4 J? = CMP-00095-1: Connector Header, PH Series, 4 Position, Side Entry, 2.00mm, Solder, Surface Mount, Natural.; Number of Positions: 4; Insulation Resistance: 1GR; Max Current Rating: 2A; Contact Resistance: 20mR; Voltage Rating (AC): 100V; Gender: Male; Pitch: 2mm; Fastening Type: Detent; Orientation: Right Angle; Lead Free: Lead Free; Housing Material: Polyamide; Packaging: Tape and Reel; Housing Color: Beige; Max Operating Temperature: 85°C; Insulation Material: Nylon; Number of Rows: 1; Number of Poles: 4; Contact Finish - Mating: TIN; Number of Contacts: 4; Reach SVHC Compliant: No; Height: 9.4mm; Series: PH; Max Voltage Rating (DC): 100V; Termination: Solder; Max Voltage Rating (AC): 100V; Contact Plating: Tin,Copper; Insulation Color: Natural; Color: White; Contact Material: Copper Alloy,Tin,Bronze,Brass; Flammability Rating: UL94 V-0; Mounting Technology: Surface Mount; Contact Type: Male Pin; Lead Pitch: 2mm; Working Voltage: 100V; Depth: 7.6mm; Connector Type: Header; Length: 11.9mm; Min Operating Temperature: -25°C; Current Rating: 2A; Voltage Rating: 100V; Width: 5mm; Contact Shape: Square

## Nets that join several sheets
GND: Accelerometer (5 pins), LCD (LCD1.3), Controls (11 pins), LEDs (10 pins), Microcontroller (6 pins), GPIO-Expander (5 pins), Battery-Switch (BT1.2 C10.1 R16.2 SW7.1), Speaker-Amplifier (10 pins), Optional-Connectors (J1.6 J4.4 J?.3 J?.4)
+3.3V_LDO: Accelerometer (6 pins), LCD (LCD1.1), Controls (7 pins), LEDs (10 pins), Microcontroller (6 pins), GPIO-Expander (6 pins), Speaker-Amplifier (FB1.1), Optional-Connectors (J4.3 J?.2)
~{SD}: Top-Level (SB1.1), Speaker-Amplifier (R23.2 U9.1)
BUTTON_A: Controls (R2.1 SW2.A SW2.A'), GPIO-Expander (U7.13), Optional-Connectors (J1.3)
BUTTON_B: Controls (R3.1 SW3.A SW3.A'), GPIO-Expander (U7.12), Optional-Connectors (J1.4)
BUTTON_SELECT: Controls (R4.1 SW4.A SW4.A'), GPIO-Expander (U7.14), Optional-Connectors (J1.5)
BUTTON_START: Controls (R5.1 SW5.A SW5.A'), GPIO-Expander (U7.16)
DEVICE_RST: LCD (LCD1.8), Microcontroller (DEV1.RX), GPIO-Expander (R14.1 U7.6)
GPIO_INT: Top-Level (SB1.2), Microcontroller (DEV1.A3), GPIO-Expander (R13.1 U7.8)
JOY_X: Controls (JOY1.X), Microcontroller (DEV1.A0), Optional-Connectors (J1.1)
JOY_Y: Controls (JOY1.Y), Microcontroller (DEV1.A1), Optional-Connectors (J1.2)
LCD_CS: LCD (LCD1.7), GPIO-Expander (U7.18)
LCD_D/C: LCD (LCD1.9), GPIO-Expander (U7.19)
LCD_LIGHT: LCD (LCD1.11), GPIO-Expander (U7.15)
LCD_TEAR: LCD (LCD1.12), Microcontroller (DEV1.A2)
MCU_RESET: Controls (R6.1 SW6.1), Microcontroller (DEV1.EN J3.10)
MCU_TX: LEDs (U2.1), Microcontroller (DEV1.TX)
MISO: LCD (LCD1.5), Microcontroller (DEV1.MISO)
MOSI: LCD (LCD1.6), Microcontroller (DEV1.MOSI)
NEOPIXEL_OUT: LEDs (U6.3), Optional-Connectors (J?.1)
SCK: LCD (LCD1.4), Microcontroller (DEV1.SCK)
SCL: Accelerometer (U1.4), Microcontroller (DEV1.SCL R1.1), GPIO-Expander (U7.1), Speaker-Amplifier (U8.5), Optional-Connectors (J4.1)
SDA: Accelerometer (U1.6), Microcontroller (DEV1.SDA R9.1), GPIO-Expander (U7.2), Speaker-Amplifier (U8.4), Optional-Connectors (J4.2)
SDC_CS: LCD (LCD1.10), GPIO-Expander (U7.17)
VBATT_DIV: Accelerometer (U1.16), Battery-Switch (R15.2 R16.1)
VBATT_SW: Microcontroller (DEV1.BAT+), Battery-Switch (M1.3)